# EAGLE schematic TrinityV1.0 (EAGLE 7.6.0)
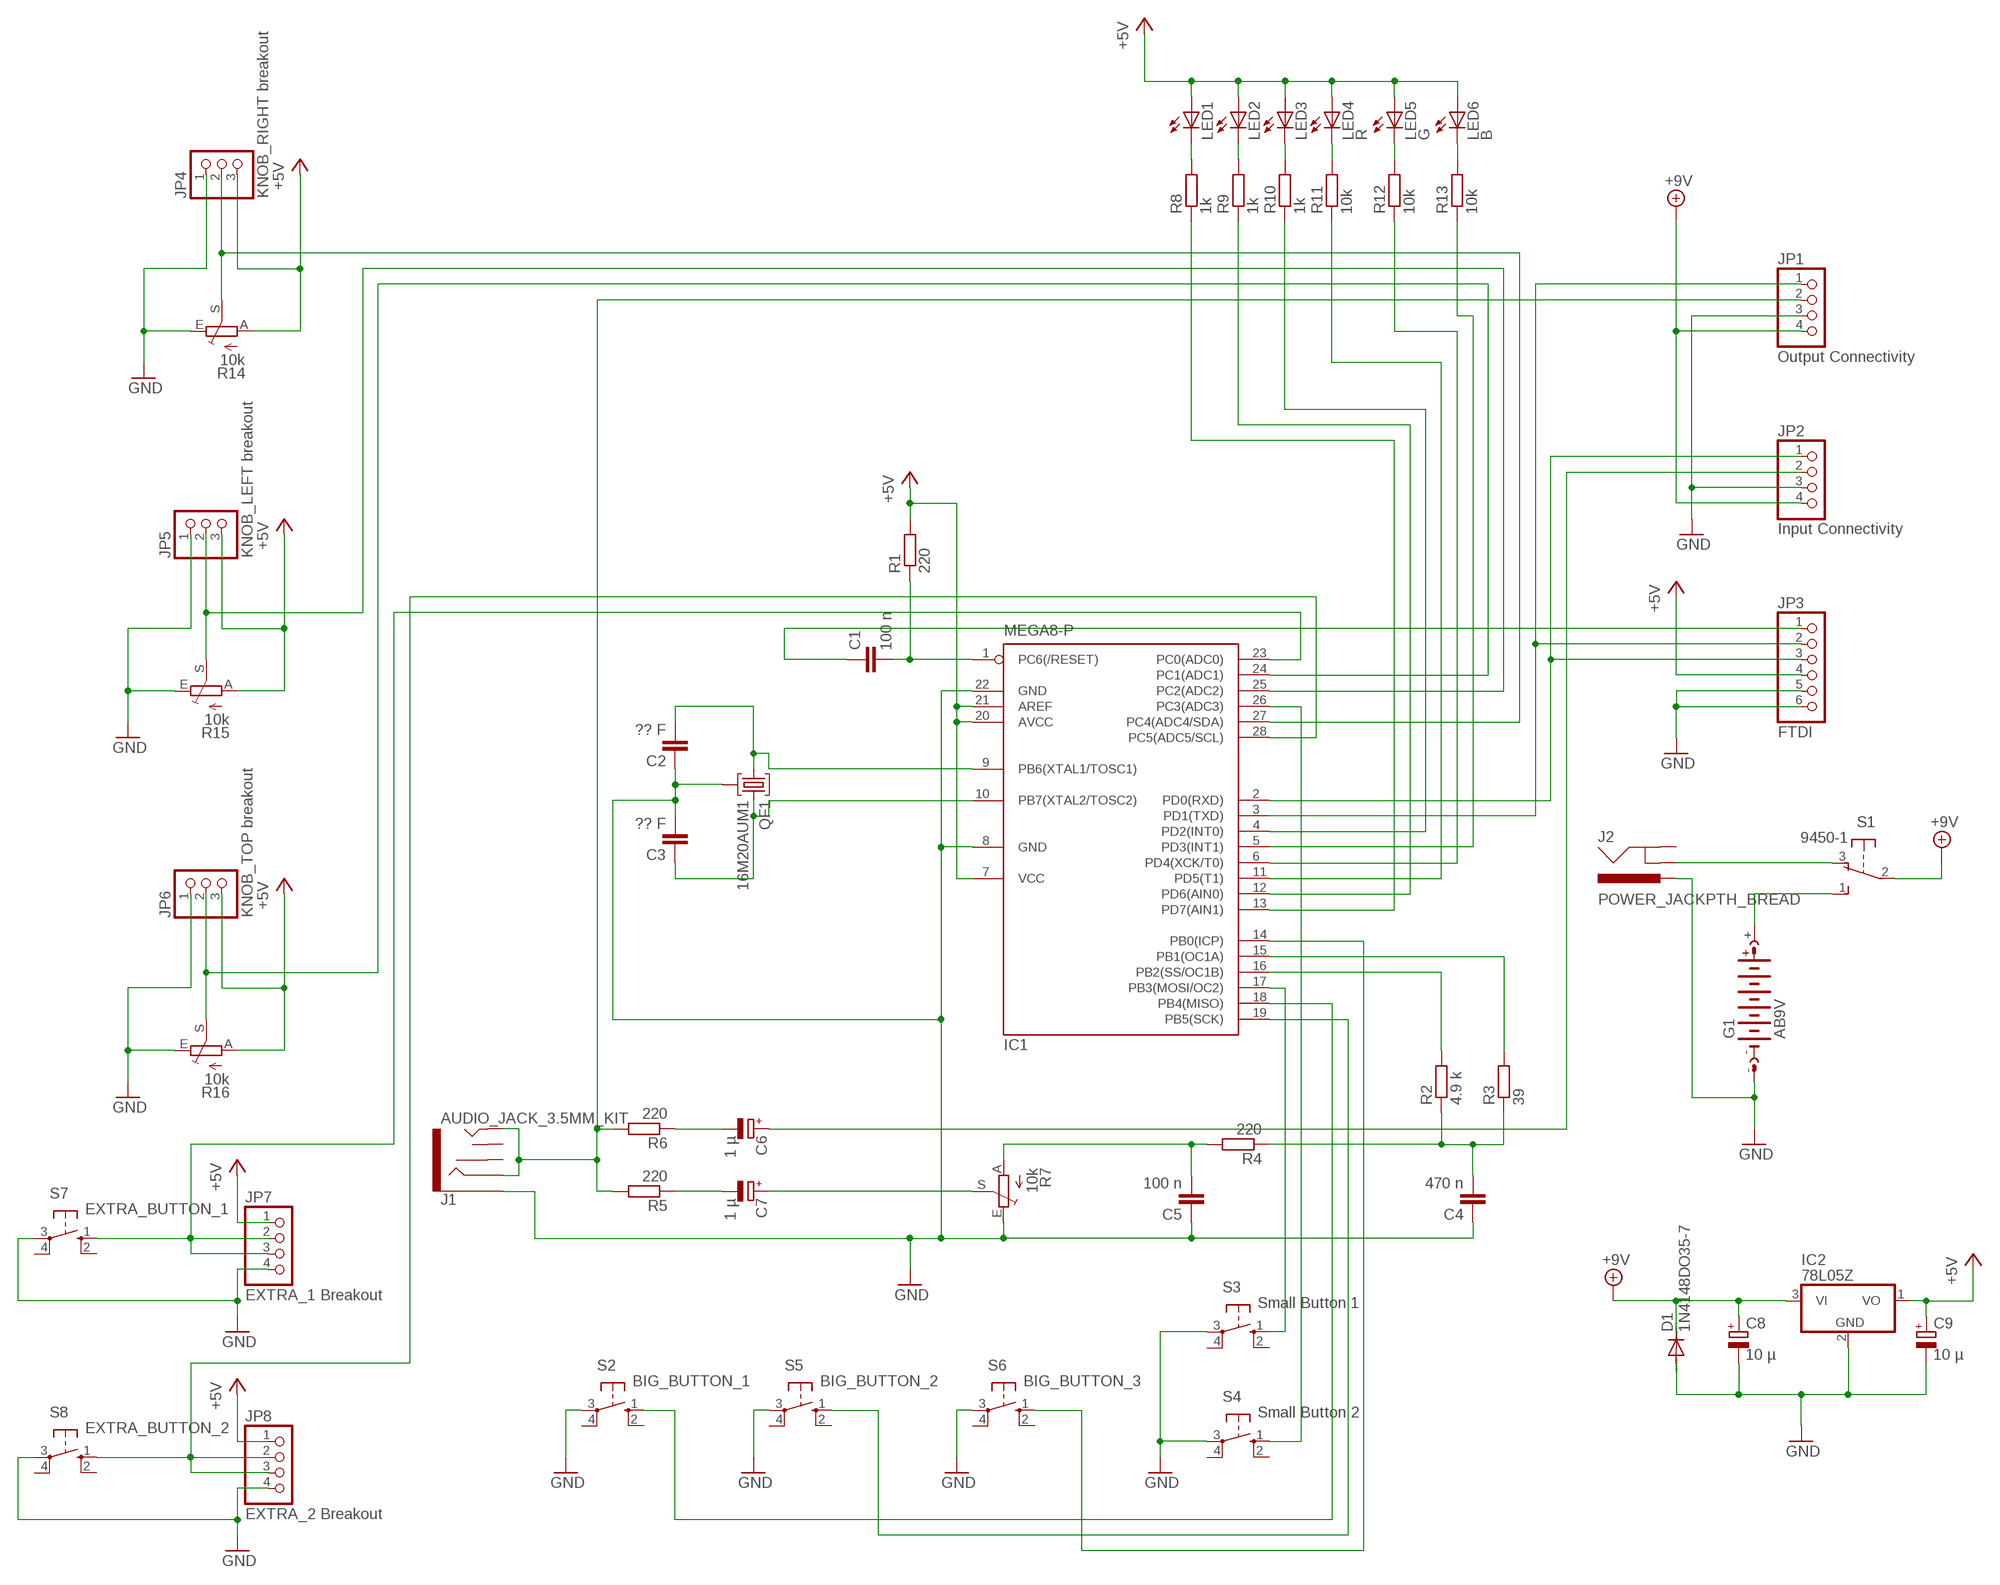
[diagram p0: schematic, sheet 1]

## Parts
C1  100 n  C-EU025-030X050  [C025-030X050]
C2  ?? F  C-EU025-030X050  [C025-030X050]
C3  ?? F  C-EU025-030X050  [C025-030X050]
C4  470 n  C-EU025-030X050  [C025-030X050]
C5  100 n  C-EU025-030X050  [C025-030X050]
C6  1 µ  CPOL-EUE2.5-6  [E2,5-6]
C7  1 µ  CPOL-EUE2.5-6  [E2,5-6]
C8  10 µ  CPOL-EUE2.5-6  [E2,5-6]
C9  10 µ  CPOL-EUE2.5-6  [E2,5-6]
D1  1N4148DO35-7  [DO35-7]
G1  AB9V  [AB9V]
IC1  MEGA8-P  [DIL28-3]
IC2  78L05Z  [TO92]
J1  AUDIO_JACK_3.5MM_KIT  [AUDIO-JACK-KIT]
J2  POWER_JACKPTH_BREAD  [POWER_JACK_PTH_BREAD]
JP1  Output Connectivity  PINHD-1X4  [1X04]
JP2  Input Connectivity  PINHD-1X4  [1X04]
JP3  FTDI  PINHD-1X6  [1X06]
JP4  KNOB_RIGHT breakout  PINHD-1X3  [1X03]
JP5  KNOB_LEFT breakout  PINHD-1X3  [1X03]
JP6  KNOB_TOP breakout  PINHD-1X3  [1X03]
JP7  EXTRA_1 Breakout  PINHD-1X4  [1X04]
JP8  EXTRA_2 Breakout  PINHD-1X4  [1X04]
LED1  LED5MM  [LED5MM]
LED2  LED5MM  [LED5MM]
LED3  LED5MM  [LED5MM]
LED4  R  LED5MM  [LED5MM]
LED5  G  LED5MM  [LED5MM]
LED6  B  LED5MM  [LED5MM]
QF1  16M20AUM1  [UM1]
R1  220  R-EU_0204/7  [0204/7]
R2  4.9 k  R-EU_0204/7  [0204/7]
R3  39  R-EU_0204/7  [0204/7]
R4  220  R-EU_0204/7  [0204/7]
R5  220  R-EU_0204/7  [0204/7]
R6  220  R-EU_0204/7  [0204/7]
R7  10k  TRIM_EU-B25U  [B25U]
R8  1k  R-EU_0204/7  [0204/7]
R9  1k  R-EU_0204/7  [0204/7]
R10  1k  R-EU_0204/7  [0204/7]
R11  10k  R-EU_0204/7  [0204/7]
R12  10k  R-EU_0204/7  [0204/7]
R13  10k  R-EU_0204/7  [0204/7]
R14  10k  TRIM_EU-B25U  [B25U]
R15  10k  TRIM_EU-B25U  [B25U]
R16  10k  TRIM_EU-B25U  [B25U]
S1  9450-1  [9450-1]
S2  BIG_BUTTON_1  40-XX  [B3F-40XX]
S3  Small Button 1  10-XX  [B3F-10XX]
S4  Small Button 2  10-XX  [B3F-10XX]
S5  BIG_BUTTON_2  40-XX  [B3F-40XX]
S6  BIG_BUTTON_3  40-XX  [B3F-40XX]
S7  EXTRA_BUTTON_1  10-XX  [B3F-10XX]
S8  EXTRA_BUTTON_2  10-XX  [B3F-10XX]

## Nets
+5V: C9.+ IC1.7(VCC) IC1.20(AVCC) IC1.21(AREF) IC2.1(VO) JP3.4 JP4.3 JP5.3 JP6.3 JP7.1 JP8.1 LED1.A LED2.A LED3.A LED4.A LED5.A LED6.A R1.2 R14.A R15.A R16.A
+9V: C8.+ D1.C IC2.3(VI) JP1.4 JP2.4 S1.2(P)
GND: C2.1 C3.2 C4.1 C5.1 C8.- C9.- D1.A G1.- IC1.8(GND) IC1.22(GND) IC2.2(GND) J1.SLEEVE J2.PWR JP1.3 JP2.3 JP3.5 JP3.6 JP4.1 JP5.1 JP6.1 JP7.4 JP8.4 QF1.2 R7.E R14.E R15.E R16.E S2.3(P) S3.3(P) S4.3(P) S5.3(P) S6.3(P) S7.3(P) S8.3(P)
N$1: LED3.K(C) R10.2
N$2: C2.2 IC1.9(PB6(XTAL1/TOSC1)) QF1.1
N$3: C3.1 IC1.10(PB7(XTAL2/TOSC2)) QF1.3
N$4: C1.2 IC1.1(PC6(/RESET)) R1.1
N$5: IC1.15(PB1(OC1A)) R3.2
N$6: C4.2 R2.1 R3.1 R4.1
N$7: IC1.16(PB2(SS/OC1B)) R2.2
N$8: C5.2 R4.2 R7.A
N$9: J2.GNDBREAK S1.3(O)
N$10: G1.+ S1.1(S)
N$11: C7.+ R7.S
N$12: C7.- R5.1
N$13: C6.- R6.1
N$14: C6.+ JP2.2
N$15: J1.RING J1.TIP JP1.2 R5.2 R6.2
N$16: C1.1 JP3.1
N$17: LED2.K(C) R9.2
N$18: LED1.K(C) R8.2
N$19: LED4.K(C) R11.2
N$20: LED5.K(C) R12.2
N$21: IC1.2(PD0(RXD)) JP2.1 JP3.3
N$22: IC1.3(PD1(TXD)) JP1.1 JP3.2
N$23: LED6.K(C) R13.2
N$24: IC1.11(PD5(T1)) R11.1
N$25: IC1.5(PD3(INT1)) R13.1
N$27: IC1.4(PD2(INT0)) R10.1
N$28: IC1.13(PD7(AIN1)) R8.1
N$29: IC1.12(PD6(AIN0)) R9.1
N$30: IC1.18(PB4(MISO)) S2.1(S)
N$31: IC1.27(PC4(ADC4/SDA)) JP4.2 R14.S
N$32: IC1.6(PD4(XCK/T0)) R12.1
N$33: IC1.28(PC5(ADC5/SCL)) JP8.2 JP8.3 S8.1(S)
N$35: IC1.24(PC1(ADC1)) JP6.2 R16.S
N$36: IC1.17(PB3(MOSI/OC2)) S3.1(S)
N$37: IC1.25(PC2(ADC2)) JP5.2 R15.S
N$38: IC1.26(PC3(ADC3)) S4.1(S)
N$39: IC1.19(PB5(SCK)) S5.1(S)
N$40: IC1.14(PB0(ICP)) S6.1(S)
N$45: IC1.23(PC0(ADC0)) JP7.2 JP7.3 S7.1(S)
Unconnected: J1.RSH J1.TSH J2.GND S2.2(S1) S2.4(P1) S3.2(S1) S3.4(P1) S4.2(S1) S4.4(P1) S5.2(S1) S5.4(P1) S6.2(S1) S6.4(P1) S7.2(S1) S7.4(P1) S8.2(S1) S8.4(P1)

## Library data of the parts
C1-C5 = resistor:C-EU: CAPACITOR, European symbol
C6-C9 = resistor:CPOL-EU: POLARIZED CAPACITOR, European symbol
D1 = diode:1N4148: DIODE high speed (Philips)
G1 = battery:AB9V: 9-V BATTERY CLIP
IC1 = atmel:MEGA8-P: MICROCONTROLLER 8 Kbytes FLASH, 1 kbytes SRAM, 512 bytes EEPROM, USART, 4-channel 10 bit ADC, 2-channel 8 bit ADC Pin compatible with Atmega48, ATMega88, ATMega168 Source: avr.lbr; OC_FARNELL: unknown; OC_NEWARK: unknown
IC2 = linear:78*: Positive VOLTAGE REGULATOR Source: http://cache.national.com/ds/LM/LM78L05.pdf http://www.fairchildsemi.com/ds/LM/LM7805.pdf
J1 = SparkFun-Connectors:AUDIO_JACK_3.5MM: Audio Jack 3.5mm variants of PTH and SMT stereo audio jack with bypass switches. SparkFun Products: SparkFun SparkPunk Sound Kit <[https://www.sparkfun.com/products/11177]> - PTH MP3 Trigger <https://www.sparkfun.com/products/13720> -3.5mm SMD SparkFun PicoBoard <https://www.sparkfun.com/products/11888>- 2.5mm SMD; PROD_ID: CONN-08774; SF_ID: PRT-08032
J2 = SparkFun-Connectors:POWER_JACK: Power Jack Connector This is the standard 5.5mm barrel jack for power. The PTH is the most common, proven, reliable, footprint. The Slot footprint only works if the mill layer is transmitted to the PCB fab house so be warned. Here are the connectors we sell at SparkFun: DC Barrel Power Jack/Connector <https://www.sparkfun.com/products/119> (PRT-00119) DC Barrel Power Jack/Connector (SMD) <https://www.sparkfun.com/products/12748> (PRT-12748) DC Barrel Jack Adapter - Breadboard Compatible <https://www.sparkfun.com/products/10811> (PRT-10811) It is used on this SparkFun product (and many, many others): SparkFun RedBoard - Programmed with Arduino <https://www.sparkfun.com/products/12757> (DEV-12757) Also, if you need a mating power supply or connector, please check these out: Wall Adapter Power Supply - 9VDC 650mA <https://www.sparkfun.com/products/298> (TOL-00298) DC Barrel Jack Adapter - Male <https://www.sparkfun.com/products/10287> (PRT-10287); PROD_ID: PRT-10811
JP1 JP2 JP7 JP8 = pinhead:PINHD-1X4: PIN HEADER
JP3 = pinhead:PINHD-1X6: PIN HEADER
JP4-JP6 = pinhead:PINHD-1X3: PIN HEADER
LED1-LED6 = led:LED: LED OSRAM: - CHIPLED LG R971, LG N971, LY N971, LG Q971, LY Q971, LO R971, LY R971 LH N974, LH R974 LS Q976, LO Q976, LY Q976 LO Q996 - Hyper CHIPLED LW Q18S LB Q993, LB Q99A, LB R99A - SideLED LS A670, LO A670, LY A670, LG A670, LP A670 LB A673, LV A673, LT A673, LW A673 LH A674 LY A675 LS A676, LA A676, LO A676, LY A676, LW A676 LS A679, LY A679, LG A679 - Hyper Micro SIDELED® LS Y876, LA Y876, LO Y876, LY Y876 LT Y87S - SmartLED LW L88C, LW L88S LB L89C, LB L89S, LG L890 LS L89K, LO L89K, LY L89K LS L896, LA L896, LO L896, LY L896 - TOPLED LS T670, LO T670, LY T670, LG T670, LP T670 LSG T670, LSP T670, LSY T670, LOP T670, LYG T670 LG T671, LOG T671, LSG T671 LB T673, LV T673, LT T673, LW T673 LH T674 LS T676, LA T676, LO T676, LY T676, LB T676, LH T676, LSB T676, LW T676 LB T67C, LV T67C, LT T67C, LS T67K, LO T67K, LY T67K, LW E67C LS E67B, LA E67B, LO E67B, LY E67B, LB E67C, LV E67C, LT E67C LW T67C LS T679, LY T679, LG T679 LS T770, LO T770, LY T770, LG T770, LP T770 LB T773, LV T773, LT T773, LW T773 LH T774 LS E675, LA E675, LY E675, LS T675 LS T776, LA T776, LO T776, LY T776, LB T776 LHGB T686 LT T68C, LB T68C - Hyper Mini TOPLED® LB M676 - Mini TOPLED Santana® LG M470 LS M47K, LO M47K, LY M47K Source: http://www.osram.convergy.de LUXEON: - LUMILED® LXK2-PW12-R00, LXK2-PW12-S00, LXK2-PW14-U00, LXK2-PW14-V00 LXK2-PM12-R00, LXK2-PM12-S00, LXK2-PM14-U00 LXK2-PE12-Q00, LXK2-PE12-R00, LXK2-PE12-S00, LXK2-PE14-T00, LXK2-PE14-U00 LXK2-PB12-K00, LXK2-PB12-L00, LXK2-PB12-M00, LXK2-PB14-N00, LXK2-PB14-P00, LXK2-PB14-Q00 LXK2-PR12-L00, LXK2-PR12-M00, LXK2-PR14-Q00, LXK2-PR14-R00 LXK2-PD12-Q00, LXK2-PD12-R00, LXK2-PD12-S00 LXK2-PH12-R00, LXK2-PH12-S00 LXK2-PL12-P00, LXK2-PL12-Q00, LXK2-PL12-R00 Source: www.luxeon.com KINGBRIGHT: KA-3528ASYC Source: www.kingbright.com
QF1 = crystal:16M20AUM1: Monolithic Crystal Filters Source: www.vanlong.com; OC_FARNELL: unknown; OC_NEWARK: unknown
R1-R6 R8-R13 = resistor:R-EU_: RESISTOR, European symbol
R7 R14-R16 = pot:TRIM_EU-: POTENTIOMETER
S1 = switch-misc:9450-1: MARQUARDT SWITCH
S2 S5 S6 = switch-omron:40-XX: OMRON SWITCH; MF: OMRON COMPONENTS USA; MPN: B3F-4000; OC_FARNELL: 176434; OC_NEWARK: 36K3105
S3 S4 S7 S8 = switch-omron:10-XX: OMRON SWITCH; MPN: B3F-1000; OC_FARNELL: 176432; OC_NEWARK: 36M3542